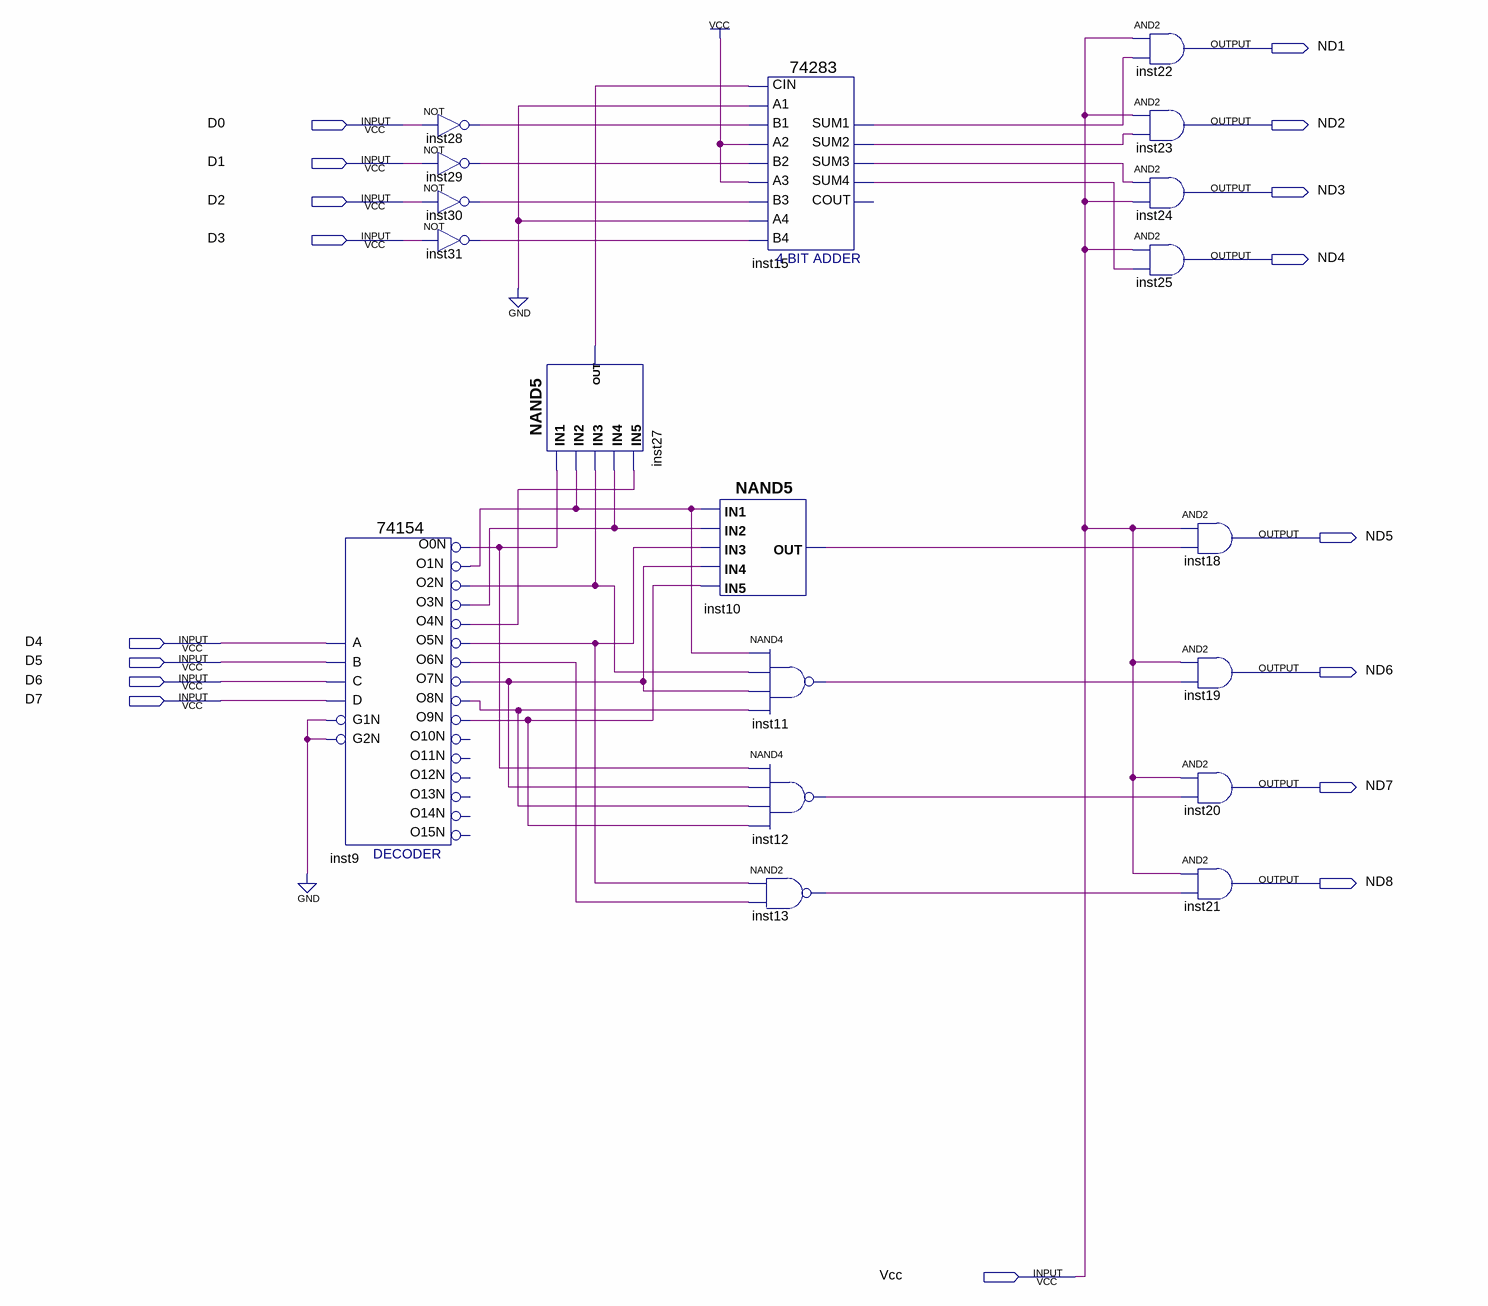
[diagram p0: schematic sheet]
// Quartus schematic TransRed.bdf as structural Verilog: 19 symbols, 17 pins
module TransRed (
  input  D0,
  input  D1,
  input  D2,
  input  D3,
  input  D4,
  input  D5,
  input  D6,
  input  D7,
  input  Vcc,
  output ND1,
  output ND2,
  output ND3,
  output ND4,
  output ND5,
  output ND6,
  output ND7,
  output ND8
);

  wire inst9_o0n, inst9_o1n, inst9_o2n, inst9_o3n, inst9_o4n, inst9_o5n, inst9_o6n, inst9_o7n, inst9_o8n,
       inst9_o9n, inst10_out, inst11_out, inst12_out, inst13_out, inst15_sum1, inst15_sum2, inst15_sum3,
       inst15_sum4, inst27_out, inst28_out, inst29_out, inst30_out, inst31_out;

  \74154  inst9 (
    .C(D6), .D(D7), .B(D5), .A(D4), .G1N(1'b0), .G2N(1'b0), .O0N(inst9_o0n), .O1N(inst9_o1n),
    .O4N(inst9_o4n), .O3N(inst9_o3n), .O2N(inst9_o2n), .O7N(inst9_o7n), .O6N(inst9_o6n), .O5N(inst9_o5n),
    .O9N(inst9_o9n), .O8N(inst9_o8n));  // open: O12N, O15N, O10N, O11N, O13N, O14N
  not inst28 (inst28_out, D0);
  not inst29 (inst29_out, D1);
  not inst30 (inst30_out, D2);
  not inst31 (inst31_out, D3);
  nand inst27 (inst27_out, inst9_o0n, inst9_o1n, inst9_o2n, inst9_o3n, inst9_o4n);
  \74283  inst15 (
    .CIN(inst27_out), .A1(1'b0), .A2(1'b1), .B2(inst29_out), .A3(1'b1), .A4(1'b0), .B4(inst31_out),
    .B1(inst28_out), .B3(inst30_out), .SUM4(inst15_sum4), .SUM1(inst15_sum1), .SUM2(inst15_sum2),
    .SUM3(inst15_sum3));  // open: COUT
  nand inst10 (inst10_out, inst9_o1n, inst9_o3n, inst9_o5n, inst9_o7n, inst9_o9n);
  nand inst11 (inst11_out, inst9_o1n, inst9_o2n, inst9_o7n, inst9_o8n);
  nand inst12 (inst12_out, inst9_o0n, inst9_o7n, inst9_o8n, inst9_o9n);
  nand inst13 (inst13_out, inst9_o5n, inst9_o6n);
  and inst22 (ND1, Vcc, inst15_sum1);
  and inst23 (ND2, Vcc, inst15_sum2);
  and inst24 (ND3, inst15_sum3, Vcc);
  and inst25 (ND4, Vcc, inst15_sum4);
  and inst18 (ND5, Vcc, inst10_out);
  and inst19 (ND6, Vcc, inst11_out);
  and inst20 (ND7, Vcc, inst12_out);
  and inst21 (ND8, Vcc, inst13_out);
endmodule
